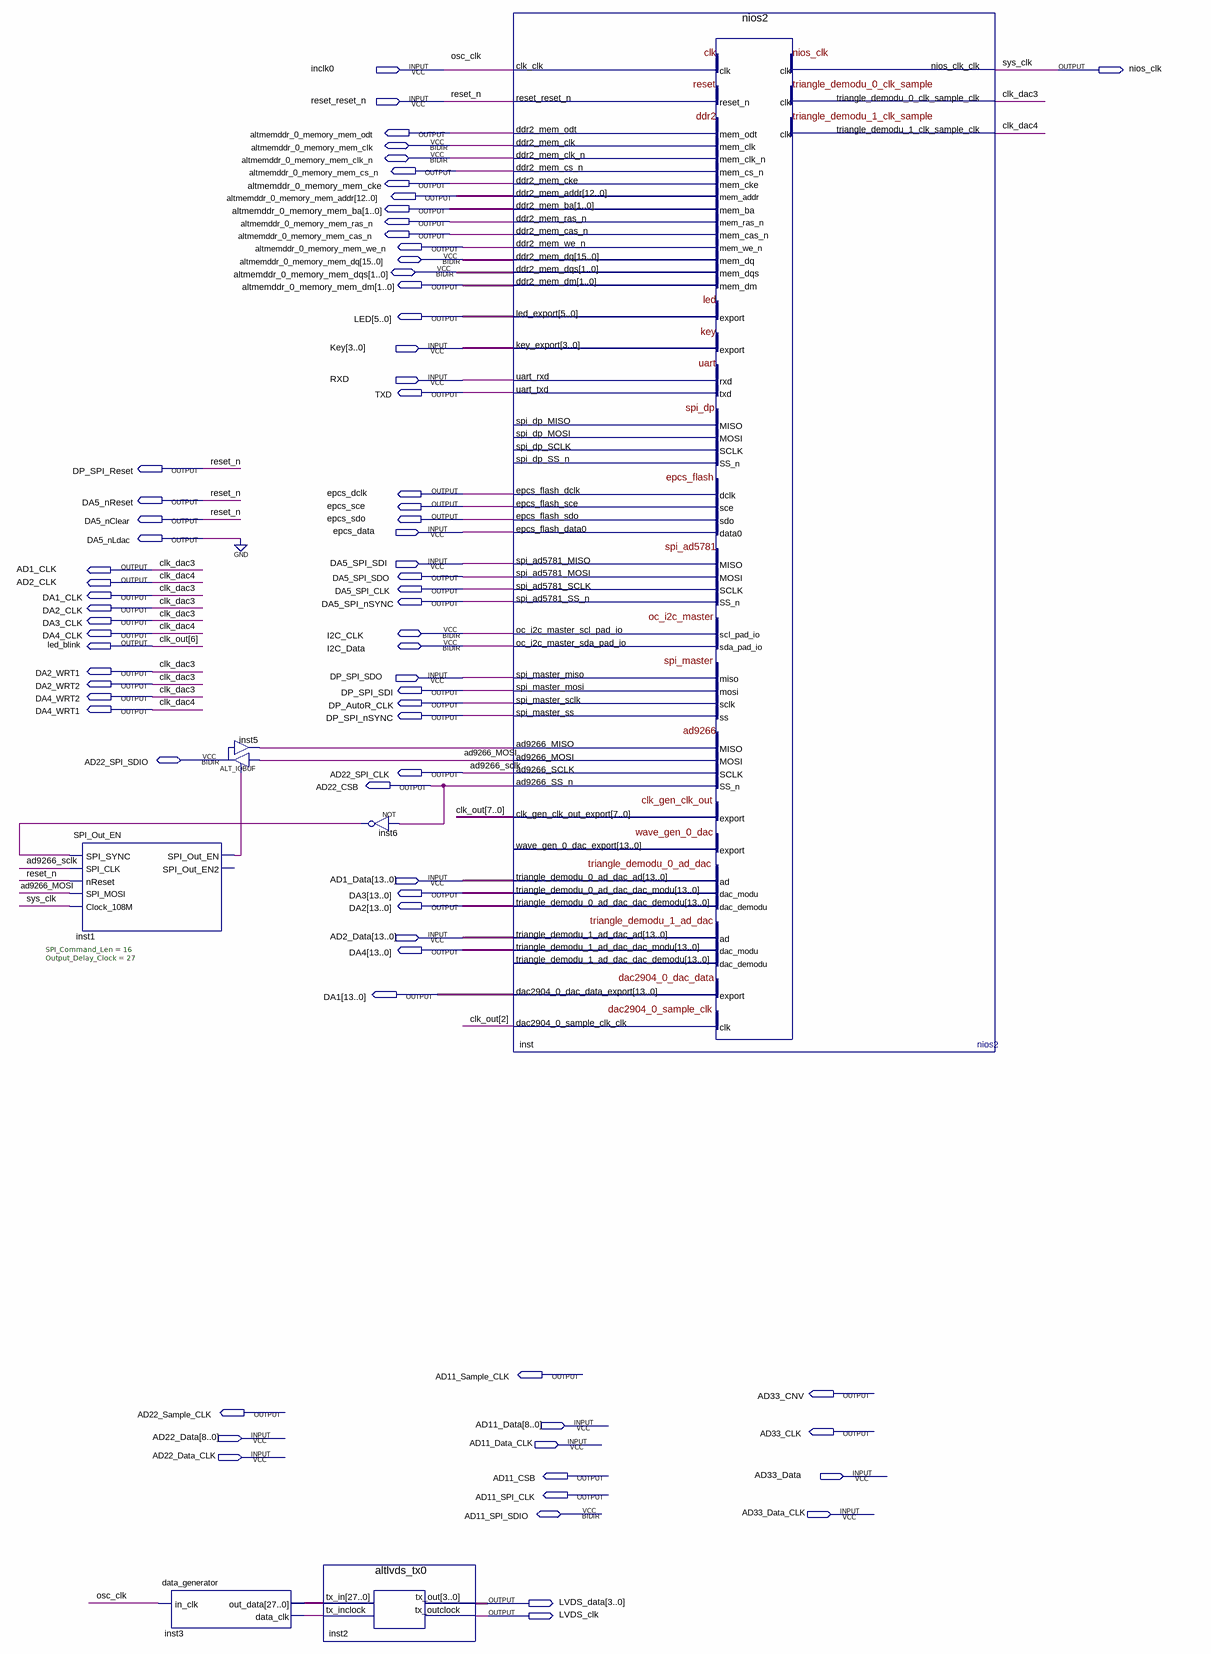
[diagram p0: schematic sheet]
// Quartus schematic ddr_layout.bdf as structural Verilog: 6 symbols, 73 pins
module ddr_layout (
  input  inclk0,
  input  reset_reset_n,
  input  [3:0] Key,
  input  RXD,
  input  epcs_data,
  input  DA5_SPI_SDI,
  input  DP_SPI_SDO,
  input  [13:0] AD1_Data,
  input  [13:0] AD2_Data,
  input  [8:0] AD11_Data,
  input  [8:0] AD22_Data,
  input  AD11_Data_CLK,
  input  AD22_Data_CLK,
  input  AD33_Data,
  input  AD33_Data_CLK,
  inout  altmemddr_0_memory_mem_clk,
  inout  altmemddr_0_memory_mem_clk_n,
  inout  [15:0] altmemddr_0_memory_mem_dq,
  inout  [1:0] altmemddr_0_memory_mem_dqs,
  inout  I2C_CLK,
  inout  I2C_Data,
  inout  AD22_SPI_SDIO,
  inout  AD11_SPI_SDIO,
  output nios_clk,
  output altmemddr_0_memory_mem_odt,
  output altmemddr_0_memory_mem_cs_n,
  output altmemddr_0_memory_mem_cke,
  output [12:0] altmemddr_0_memory_mem_addr,
  output [1:0] altmemddr_0_memory_mem_ba,
  output altmemddr_0_memory_mem_ras_n,
  output altmemddr_0_memory_mem_cas_n,
  output altmemddr_0_memory_mem_we_n,
  output [1:0] altmemddr_0_memory_mem_dm,
  output [5:0] LED,
  output TXD,
  output DP_SPI_Reset,
  output epcs_dclk,
  output DA5_nReset,
  output epcs_sce,
  output DA5_nClear,
  output epcs_sdo,
  output DA5_nLdac,
  output AD1_CLK,
  output DA5_SPI_SDO,
  output AD2_CLK,
  output DA5_SPI_CLK,
  output DA1_CLK,
  output DA5_SPI_nSYNC,
  output DA2_CLK,
  output DA3_CLK,
  output DA4_CLK,
  output led_blink,
  output DA2_WRT1,
  output DA2_WRT2,
  output DP_SPI_SDI,
  output DA4_WRT2,
  output DP_AutoR_CLK,
  output DA4_WRT1,
  output DP_SPI_nSYNC,
  output AD22_SPI_CLK,
  output AD22_CSB,
  output [13:0] DA3,
  output [13:0] DA2,
  output [13:0] DA4,
  output [13:0] DA1,
  output AD11_Sample_CLK,
  output AD33_CNV,
  output AD22_Sample_CLK,
  output AD33_CLK,
  output AD11_CSB,
  output AD11_SPI_CLK,
  output [3:0] LVDS_data,
  output LVDS_clk
);

  wire ad9266_MOSI, inst1_spi_out_en, inst3_data_clk, inst5_o, inst6_out;
  wire [7:0] clk_out;
  wire [27:0] inst3_out_data;

  SPI_Out_EN #(.SPI_Command_Len(16), .Output_Delay_Clock(27)) inst1 (
    .SPI_SYNC(inst6_out), .SPI_CLK(AD22_SPI_CLK), .nReset(reset_reset_n), .SPI_MOSI(ad9266_MOSI),
    .Clock_108M(nios_clk), .SPI_Out_EN(inst1_spi_out_en));  // open: SPI_Out_EN2
  data_generator inst3 (.in_clk(inclk0), .out_data(inst3_out_data), .data_clk(inst3_data_clk));
  ALT_IOBUF inst5 (.i(ad9266_MOSI), .oe(inst1_spi_out_en), .o(inst5_o), .io(AD22_SPI_SDIO));
  not inst6 (inst6_out, AD22_CSB);
  altlvds_tx0 inst2 (.tx_in(inst3_out_data), .tx_inclock(inst3_data_clk), .tx_out(LVDS_data), .tx_outclock(LVDS_clk));
  nios2 inst (
    .clk_clk(inclk0), .reset_reset_n(reset_reset_n), .key_export(Key), .uart_rxd(RXD),
    .epcs_flash_data0(epcs_data), .spi_ad5781_MISO(DA5_SPI_SDI), .spi_master_miso(DP_SPI_SDO),
    .ad9266_MISO(inst5_o), .triangle_demodu_0_ad_dac_ad(AD1_Data), .triangle_demodu_1_ad_dac_ad(AD2_Data),
    .dac2904_0_sample_clk_clk(clk_out[2]), .ddr2_mem_odt(altmemddr_0_memory_mem_odt),
    .ddr2_mem_cs_n(altmemddr_0_memory_mem_cs_n), .ddr2_mem_cke(altmemddr_0_memory_mem_cke),
    .ddr2_mem_addr(altmemddr_0_memory_mem_addr), .ddr2_mem_ba(altmemddr_0_memory_mem_ba),
    .ddr2_mem_ras_n(altmemddr_0_memory_mem_ras_n), .ddr2_mem_cas_n(altmemddr_0_memory_mem_cas_n),
    .ddr2_mem_we_n(altmemddr_0_memory_mem_we_n), .ddr2_mem_dm(altmemddr_0_memory_mem_dm), .led_export(LED),
    .uart_txd(TXD), .epcs_flash_dclk(epcs_dclk), .epcs_flash_sce(epcs_sce), .epcs_flash_sdo(epcs_sdo),
    .spi_ad5781_MOSI(DA5_SPI_SDO), .spi_ad5781_SCLK(DA5_SPI_CLK), .spi_ad5781_SS_n(DA5_SPI_nSYNC),
    .nios_clk_clk(nios_clk), .spi_master_mosi(DP_SPI_SDI), .spi_master_sclk(DP_AutoR_CLK),
    .spi_master_ss(DP_SPI_nSYNC), .ad9266_MOSI(ad9266_MOSI), .ad9266_SCLK(AD22_SPI_CLK),
    .ad9266_SS_n(AD22_CSB), .clk_gen_clk_out_export({clk_out[7], led_blink, clk_out[5:0]}),
    .triangle_demodu_0_clk_sample_clk(AD1_CLK), .triangle_demodu_0_ad_dac_dac_modu(DA3),
    .triangle_demodu_0_ad_dac_dac_demodu(DA2), .triangle_demodu_1_clk_sample_clk(AD2_CLK),
    .triangle_demodu_1_ad_dac_dac_modu(DA4), .dac2904_0_dac_data_export(DA1),
    .ddr2_mem_clk(altmemddr_0_memory_mem_clk), .ddr2_mem_clk_n(altmemddr_0_memory_mem_clk_n),
    .ddr2_mem_dq(altmemddr_0_memory_mem_dq), .ddr2_mem_dqs(altmemddr_0_memory_mem_dqs),
    .oc_i2c_master_scl_pad_io(I2C_CLK), .oc_i2c_master_sda_pad_io(I2C_Data));  // open: spi_dp_MISO, spi_dp_MOSI, spi_dp_SCLK, spi_dp_SS_n, wave_gen_0_dac_export, triangle_demodu_1_ad_dac_dac_demodu

  assign DA1_CLK = AD1_CLK;
  assign DA2_CLK = AD1_CLK;
  assign DA2_WRT1 = AD1_CLK;
  assign DA2_WRT2 = AD1_CLK;
  assign DA3_CLK = AD1_CLK;
  assign DA4_CLK = AD2_CLK;
  assign DA4_WRT1 = AD2_CLK;
  assign DA4_WRT2 = AD1_CLK;
  assign DA5_nClear = reset_reset_n;
  assign DA5_nLdac = 1'b0;
  assign DA5_nReset = reset_reset_n;
  assign DP_SPI_Reset = reset_reset_n;

  // Other names for the same wires on the sheet: ad9266_sclk = AD22_SPI_CLK; clk_dac3 = AD1_CLK; clk_dac4 = AD2_CLK;
  //   clk_out[6] = led_blink; osc_clk = inclk0; reset_n = reset_reset_n; sys_clk = nios_clk
endmodule
